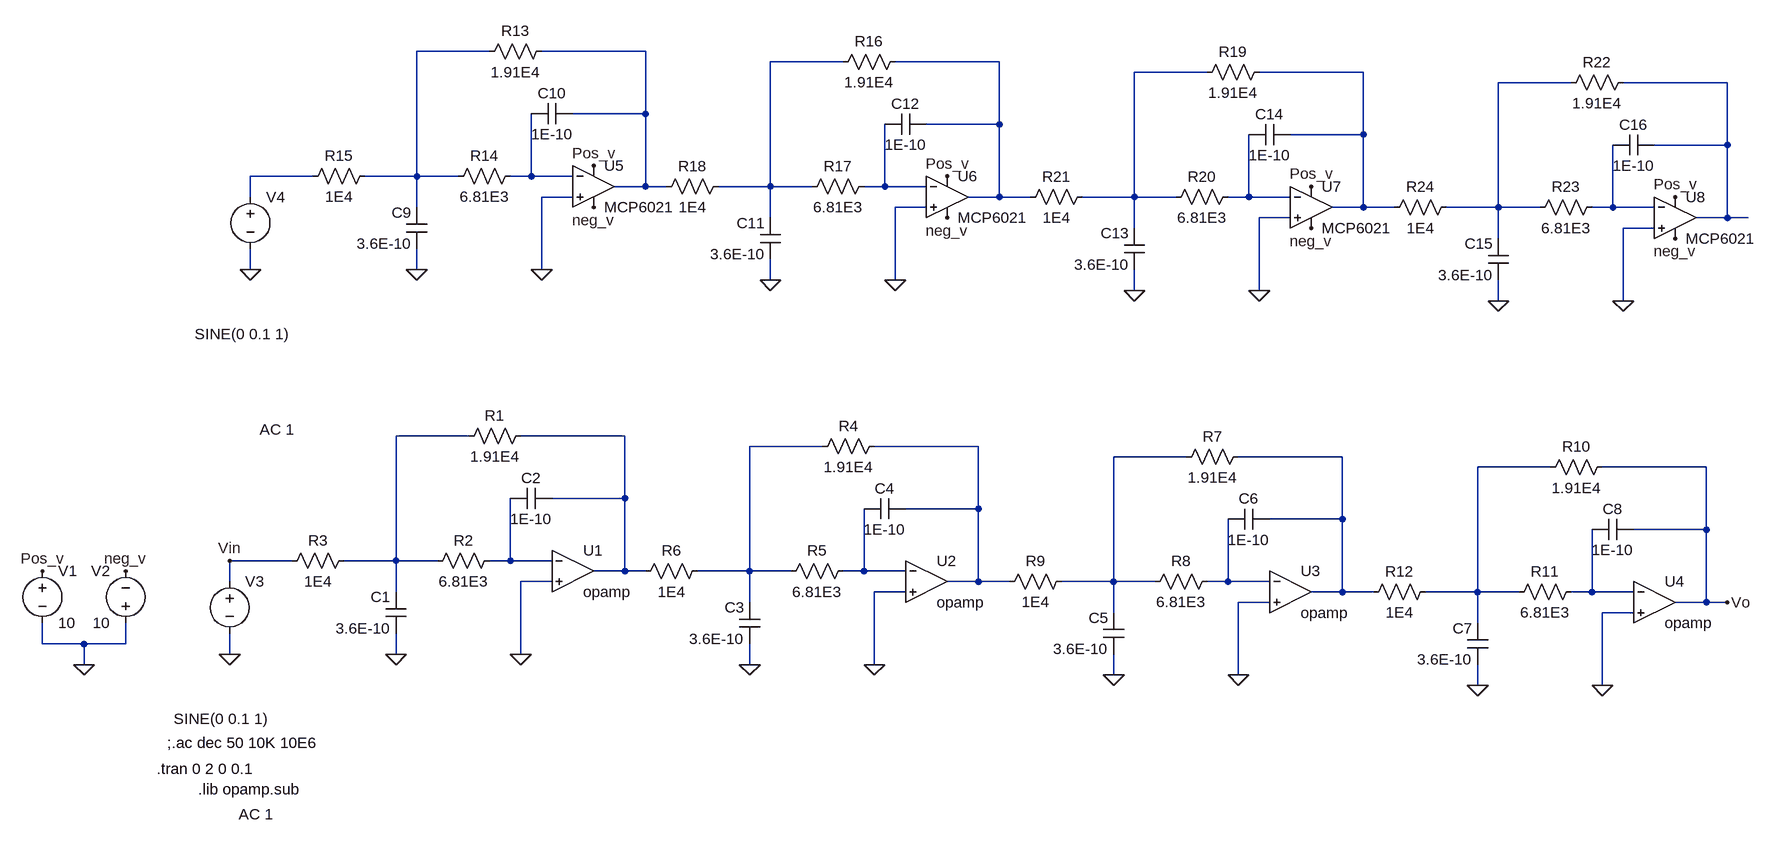
[diagram p0: schematic Draft2.asc]
Draft2.asc, the LTspice schematic file:
Version 4
SHEET 1 1680 680
WIRE -304 -592 -416 -592
WIRE -64 -592 -224 -592
WIRE 240 -576 128 -576
WIRE 480 -576 320 -576
WIRE 800 -560 688 -560
WIRE 1040 -560 880 -560
WIRE 1360 -544 1248 -544
WIRE 1600 -544 1440 -544
WIRE -64 -496 -64 -592
WIRE -64 -496 -176 -496
WIRE 480 -480 480 -576
WIRE 480 -480 368 -480
WIRE 1040 -464 1040 -560
WIRE 1040 -464 928 -464
WIRE 1600 -448 1600 -544
WIRE 1600 -448 1488 -448
WIRE -576 -400 -672 -400
WIRE -416 -400 -416 -592
WIRE -416 -400 -496 -400
WIRE -352 -400 -416 -400
WIRE -240 -400 -240 -496
WIRE -240 -400 -272 -400
WIRE -176 -400 -240 -400
WIRE -64 -384 -64 -496
WIRE -64 -384 -112 -384
WIRE -32 -384 -64 -384
WIRE 128 -384 128 -576
WIRE 128 -384 48 -384
WIRE 192 -384 128 -384
WIRE 304 -384 304 -480
WIRE 304 -384 272 -384
WIRE 368 -384 304 -384
WIRE -672 -368 -672 -400
WIRE -176 -368 -224 -368
WIRE 480 -368 480 -480
WIRE 480 -368 432 -368
WIRE 528 -368 480 -368
WIRE 688 -368 688 -560
WIRE 688 -368 608 -368
WIRE 752 -368 688 -368
WIRE 864 -368 864 -464
WIRE 864 -368 832 -368
WIRE 928 -368 864 -368
WIRE -416 -352 -416 -400
WIRE 368 -352 320 -352
WIRE 1040 -352 1040 -464
WIRE 1040 -352 992 -352
WIRE 1088 -352 1040 -352
WIRE 1248 -352 1248 -544
WIRE 1248 -352 1168 -352
WIRE 1312 -352 1248 -352
WIRE 1424 -352 1424 -448
WIRE 1424 -352 1392 -352
WIRE 1488 -352 1424 -352
WIRE 128 -336 128 -384
WIRE 928 -336 880 -336
WIRE 1600 -336 1600 -448
WIRE 1600 -336 1552 -336
WIRE 1632 -336 1600 -336
WIRE 688 -320 688 -368
WIRE 1488 -320 1440 -320
WIRE 1248 -304 1248 -352
WIRE -672 -256 -672 -288
WIRE -416 -256 -416 -288
WIRE -224 -256 -224 -368
WIRE 128 -240 128 -272
WIRE 320 -240 320 -352
WIRE 688 -224 688 -256
WIRE 880 -224 880 -336
WIRE 1248 -208 1248 -240
WIRE 1440 -208 1440 -320
WIRE -336 0 -448 0
WIRE -96 0 -256 0
WIRE 208 16 96 16
WIRE 448 16 288 16
WIRE 768 32 656 32
WIRE 1008 32 848 32
WIRE 1328 48 1216 48
WIRE 1568 48 1408 48
WIRE -96 96 -96 0
WIRE -96 96 -208 96
WIRE 448 112 448 16
WIRE 448 112 336 112
WIRE 1008 128 1008 32
WIRE 1008 128 896 128
WIRE 1568 144 1568 48
WIRE 1568 144 1456 144
WIRE -608 192 -704 192
WIRE -448 192 -448 0
WIRE -448 192 -528 192
WIRE -384 192 -448 192
WIRE -272 192 -272 96
WIRE -272 192 -304 192
WIRE -208 192 -272 192
WIRE -96 208 -96 96
WIRE -96 208 -144 208
WIRE -64 208 -96 208
WIRE 96 208 96 16
WIRE 96 208 16 208
WIRE 160 208 96 208
WIRE 272 208 272 112
WIRE 272 208 240 208
WIRE 336 208 272 208
WIRE -704 224 -704 192
WIRE -208 224 -256 224
WIRE 448 224 448 112
WIRE 448 224 400 224
WIRE 496 224 448 224
WIRE 656 224 656 32
WIRE 656 224 576 224
WIRE 720 224 656 224
WIRE 832 224 832 128
WIRE 832 224 800 224
WIRE 896 224 832 224
WIRE -448 240 -448 192
WIRE 336 240 288 240
WIRE 1008 240 1008 128
WIRE 1008 240 960 240
WIRE 1056 240 1008 240
WIRE 1216 240 1216 48
WIRE 1216 240 1136 240
WIRE 1280 240 1216 240
WIRE 1392 240 1392 144
WIRE 1392 240 1360 240
WIRE 1456 240 1392 240
WIRE 96 256 96 208
WIRE 896 256 848 256
WIRE 1568 256 1568 144
WIRE 1568 256 1520 256
WIRE 1600 256 1568 256
WIRE 656 272 656 224
WIRE 1456 272 1408 272
WIRE 1216 288 1216 240
WIRE -992 320 -992 288
WIRE -928 320 -992 320
WIRE -864 320 -864 288
WIRE -864 320 -928 320
WIRE -704 336 -704 304
WIRE -448 336 -448 304
WIRE -256 336 -256 224
WIRE -928 352 -928 320
WIRE 96 352 96 320
WIRE 288 352 288 240
WIRE 656 368 656 336
WIRE 848 368 848 256
WIRE 1216 384 1216 352
WIRE 1408 384 1408 272
FLAG -992 208 Pos_v
FLAG -864 208 neg_v
FLAG -928 352 0
FLAG -256 336 0
FLAG -448 336 0
FLAG -704 336 0
FLAG -704 192 Vin
FLAG 288 352 0
FLAG 96 352 0
FLAG 848 368 0
FLAG 656 368 0
FLAG 1408 384 0
FLAG 1216 384 0
FLAG 1600 256 Vo
FLAG -224 -256 0
FLAG -416 -256 0
FLAG -672 -256 0
FLAG 320 -240 0
FLAG 128 -240 0
FLAG 880 -224 0
FLAG 688 -224 0
FLAG 1440 -208 0
FLAG 1248 -208 0
FLAG -144 -416 Pos_v
FLAG -144 -352 neg_v
FLAG 400 -400 Pos_v
FLAG 400 -336 neg_v
FLAG 960 -384 Pos_v
FLAG 960 -320 neg_v
FLAG 1520 -368 Pos_v
FLAG 1520 -304 neg_v
SYMBOL voltage -992 192 R0
WINDOW 123 0 0 Left 0
WINDOW 39 0 0 Left 0
SYMATTR InstName V1
SYMATTR Value 10
SYMBOL voltage -864 304 R180
WINDOW 0 24 96 Left 2
WINDOW 3 24 16 Left 2
SYMATTR InstName V2
SYMATTR Value 10
SYMBOL res -240 -16 R90
WINDOW 0 0 56 VBottom 2
WINDOW 3 32 56 VTop 2
SYMATTR InstName R1
SYMATTR Value 1.91E4
SYMBOL res -288 176 R90
WINDOW 0 0 56 VBottom 2
WINDOW 3 32 56 VTop 2
SYMATTR InstName R2
SYMATTR Value 6.81E3
SYMBOL res -512 176 R90
WINDOW 0 0 56 VBottom 2
WINDOW 3 32 56 VTop 2
SYMATTR InstName R3
SYMATTR Value 1E4
SYMBOL cap -432 304 R180
WINDOW 0 24 56 Left 2
WINDOW 3 24 8 Left 2
SYMATTR InstName C1
SYMATTR Value 3.6E-10
SYMBOL cap -272 112 R270
WINDOW 0 32 32 VTop 2
WINDOW 3 0 32 VBottom 2
SYMATTR InstName C2
SYMATTR Value 1E-10
SYMBOL voltage -704 208 R0
WINDOW 123 14 374 Left 2
WINDOW 39 0 0 Left 0
WINDOW 3 -86 227 Left 2
SYMATTR Value2 AC 1
SYMATTR Value SINE(0 0.1 1)
SYMATTR InstName V3
SYMBOL res 304 0 R90
WINDOW 0 0 56 VBottom 2
WINDOW 3 32 56 VTop 2
SYMATTR InstName R4
SYMATTR Value 1.91E4
SYMBOL res 256 192 R90
WINDOW 0 0 56 VBottom 2
WINDOW 3 32 56 VTop 2
SYMATTR InstName R5
SYMATTR Value 6.81E3
SYMBOL res 32 192 R90
WINDOW 0 0 56 VBottom 2
WINDOW 3 32 56 VTop 2
SYMATTR InstName R6
SYMATTR Value 1E4
SYMBOL cap 112 320 R180
WINDOW 0 24 56 Left 2
WINDOW 3 24 8 Left 2
SYMATTR InstName C3
SYMATTR Value 3.6E-10
SYMBOL cap 272 128 R270
WINDOW 0 32 32 VTop 2
WINDOW 3 0 32 VBottom 2
SYMATTR InstName C4
SYMATTR Value 1E-10
SYMBOL res 864 16 R90
WINDOW 0 0 56 VBottom 2
WINDOW 3 32 56 VTop 2
SYMATTR InstName R7
SYMATTR Value 1.91E4
SYMBOL res 816 208 R90
WINDOW 0 0 56 VBottom 2
WINDOW 3 32 56 VTop 2
SYMATTR InstName R8
SYMATTR Value 6.81E3
SYMBOL res 592 208 R90
WINDOW 0 0 56 VBottom 2
WINDOW 3 32 56 VTop 2
SYMATTR InstName R9
SYMATTR Value 1E4
SYMBOL cap 672 336 R180
WINDOW 0 24 56 Left 2
WINDOW 3 24 8 Left 2
SYMATTR InstName C5
SYMATTR Value 3.6E-10
SYMBOL cap 832 144 R270
WINDOW 0 32 32 VTop 2
WINDOW 3 0 32 VBottom 2
SYMATTR InstName C6
SYMATTR Value 1E-10
SYMBOL res 1424 32 R90
WINDOW 0 0 56 VBottom 2
WINDOW 3 32 56 VTop 2
SYMATTR InstName R10
SYMATTR Value 1.91E4
SYMBOL res 1376 224 R90
WINDOW 0 0 56 VBottom 2
WINDOW 3 32 56 VTop 2
SYMATTR InstName R11
SYMATTR Value 6.81E3
SYMBOL res 1152 224 R90
WINDOW 0 0 56 VBottom 2
WINDOW 3 32 56 VTop 2
SYMATTR InstName R12
SYMATTR Value 1E4
SYMBOL cap 1232 352 R180
WINDOW 0 24 56 Left 2
WINDOW 3 24 8 Left 2
SYMATTR InstName C7
SYMATTR Value 3.6E-10
SYMBOL cap 1392 160 R270
WINDOW 0 32 32 VTop 2
WINDOW 3 0 32 VBottom 2
SYMATTR InstName C8
SYMATTR Value 1E-10
SYMBOL Opamps\\opamp -176 144 R0
SYMATTR InstName U1
SYMBOL Opamps\\opamp 368 160 R0
SYMATTR InstName U2
SYMBOL Opamps\\opamp 928 176 R0
SYMATTR InstName U3
SYMBOL Opamps\\opamp 1488 192 R0
SYMATTR InstName U4
SYMBOL res -208 -608 R90
WINDOW 0 0 56 VBottom 2
WINDOW 3 32 56 VTop 2
SYMATTR InstName R13
SYMATTR Value 1.91E4
SYMBOL res -256 -416 R90
WINDOW 0 0 56 VBottom 2
WINDOW 3 32 56 VTop 2
SYMATTR InstName R14
SYMATTR Value 6.81E3
SYMBOL res -480 -416 R90
WINDOW 0 0 56 VBottom 2
WINDOW 3 32 56 VTop 2
SYMATTR InstName R15
SYMATTR Value 1E4
SYMBOL cap -400 -288 R180
WINDOW 0 24 56 Left 2
WINDOW 3 24 8 Left 2
SYMATTR InstName C9
SYMATTR Value 3.6E-10
SYMBOL cap -240 -480 R270
WINDOW 0 32 32 VTop 2
WINDOW 3 0 32 VBottom 2
SYMATTR InstName C10
SYMATTR Value 1E-10
SYMBOL voltage -672 -384 R0
WINDOW 123 14 374 Left 2
WINDOW 39 0 0 Left 0
WINDOW 3 -86 227 Left 2
SYMATTR Value2 AC 1
SYMATTR Value SINE(0 0.1 1)
SYMATTR InstName V4
SYMBOL res 336 -592 R90
WINDOW 0 0 56 VBottom 2
WINDOW 3 32 56 VTop 2
SYMATTR InstName R16
SYMATTR Value 1.91E4
SYMBOL res 288 -400 R90
WINDOW 0 0 56 VBottom 2
WINDOW 3 32 56 VTop 2
SYMATTR InstName R17
SYMATTR Value 6.81E3
SYMBOL res 64 -400 R90
WINDOW 0 0 56 VBottom 2
WINDOW 3 32 56 VTop 2
SYMATTR InstName R18
SYMATTR Value 1E4
SYMBOL cap 144 -272 R180
WINDOW 0 24 56 Left 2
WINDOW 3 24 8 Left 2
SYMATTR InstName C11
SYMATTR Value 3.6E-10
SYMBOL cap 304 -464 R270
WINDOW 0 32 32 VTop 2
WINDOW 3 0 32 VBottom 2
SYMATTR InstName C12
SYMATTR Value 1E-10
SYMBOL res 896 -576 R90
WINDOW 0 0 56 VBottom 2
WINDOW 3 32 56 VTop 2
SYMATTR InstName R19
SYMATTR Value 1.91E4
SYMBOL res 848 -384 R90
WINDOW 0 0 56 VBottom 2
WINDOW 3 32 56 VTop 2
SYMATTR InstName R20
SYMATTR Value 6.81E3
SYMBOL res 624 -384 R90
WINDOW 0 0 56 VBottom 2
WINDOW 3 32 56 VTop 2
SYMATTR InstName R21
SYMATTR Value 1E4
SYMBOL cap 704 -256 R180
WINDOW 0 24 56 Left 2
WINDOW 3 24 8 Left 2
SYMATTR InstName C13
SYMATTR Value 3.6E-10
SYMBOL cap 864 -448 R270
WINDOW 0 32 32 VTop 2
WINDOW 3 0 32 VBottom 2
SYMATTR InstName C14
SYMATTR Value 1E-10
SYMBOL res 1456 -560 R90
WINDOW 0 0 56 VBottom 2
WINDOW 3 32 56 VTop 2
SYMATTR InstName R22
SYMATTR Value 1.91E4
SYMBOL res 1408 -368 R90
WINDOW 0 0 56 VBottom 2
WINDOW 3 32 56 VTop 2
SYMATTR InstName R23
SYMATTR Value 6.81E3
SYMBOL res 1184 -368 R90
WINDOW 0 0 56 VBottom 2
WINDOW 3 32 56 VTop 2
SYMATTR InstName R24
SYMATTR Value 1E4
SYMBOL cap 1264 -240 R180
WINDOW 0 24 56 Left 2
WINDOW 3 24 8 Left 2
SYMATTR InstName C15
SYMATTR Value 3.6E-10
SYMBOL cap 1424 -432 R270
WINDOW 0 32 32 VTop 2
WINDOW 3 0 32 VBottom 2
SYMATTR InstName C16
SYMATTR Value 1E-10
SYMBOL AutoGenerated\\MCP6021 -144 -384 R0
SYMATTR InstName U5
SYMBOL AutoGenerated\\MCP6021 400 -368 R0
SYMATTR InstName U6
SYMBOL AutoGenerated\\MCP6021 960 -352 R0
SYMATTR InstName U7
SYMBOL AutoGenerated\\MCP6021 1520 -336 R0
SYMATTR InstName U8
TEXT -800 472 Left 2 !;.ac dec 50 10K 10E6
TEXT -816 512 Left 2 !.tran 0 2 0 0.1
TEXT -752 544 Left 2 !.lib opamp.sub

The netlist it stands for:
* Draft2.asc
V1 Pos_v 0 10
V2 0 neg_v 10
R1 N015 N014 1.91E4
R2 N021 N014 6.81E3
R3 N014 Vin 1E4
C1 0 N014 3.6E-10
C2 N021 N015 1E-10
V3 Vin 0 SINE(0 0.1 1) AC 1
R4 N017 N016 1.91E4
R5 N022 N016 6.81E3
R6 N016 N015 1E4
C3 0 N016 3.6E-10
C4 N022 N017 1E-10
R7 N019 N018 1.91E4
R8 N023 N018 6.81E3
R9 N018 N017 1E4
C5 0 N018 3.6E-10
C6 N023 N019 1E-10
R10 Vo N020 1.91E4
R11 N024 N020 6.81E3
R12 N020 N019 1E4
C7 0 N020 3.6E-10
C8 N024 Vo 1E-10
XU1 N021 0 N015 opamp Aol=100K GBW=10Meg  ; pins invin noninvin out
XU2 N022 0 N017 opamp Aol=100K GBW=10Meg  ; pins invin noninvin out
XU3 N023 0 N019 opamp Aol=100K GBW=10Meg  ; pins invin noninvin out
XU4 N024 0 Vo opamp Aol=100K GBW=10Meg  ; pins invin noninvin out
R13 N002 N001 1.91E4
R14 N010 N001 6.81E3
R15 N001 N009 1E4
C9 0 N001 3.6E-10
C10 N010 N002 1E-10
V4 N009 0 SINE(0 0.1 1) AC 1
R16 N004 N003 1.91E4
R17 N011 N003 6.81E3
R18 N003 N002 1E4
C11 0 N003 3.6E-10
C12 N011 N004 1E-10
R19 N006 N005 1.91E4
R20 N012 N005 6.81E3
R21 N005 N004 1E4
C13 0 N005 3.6E-10
C14 N012 N006 1E-10
R22 N008 N007 1.91E4
R23 N013 N007 6.81E3
R24 N007 N006 1E4
C15 0 N007 3.6E-10
C16 N013 N008 1E-10
* U5: MCP6021 (symbol AutoGenerated\MCP6021 not available, pins judged from their places): In+=0 In-=N010 V+=Pos_v V-=neg_v OUT=N002
* U6: MCP6021 (symbol AutoGenerated\MCP6021 not available, pins judged from their places): In+=0 In-=N011 V+=Pos_v V-=neg_v OUT=N004
* U7: MCP6021 (symbol AutoGenerated\MCP6021 not available, pins judged from their places): In+=0 In-=N012 V+=Pos_v V-=neg_v OUT=N006
* U8: MCP6021 (symbol AutoGenerated\MCP6021 not available, pins judged from their places): In+=0 In-=N013 V+=Pos_v V-=neg_v OUT=N008
;.ac dec 50 10K 10E6
.tran 0 2 0 0.1
.lib opamp.sub
.backanno
.end